# EAGLE design coverter_board (EAGLE 9.4.2)
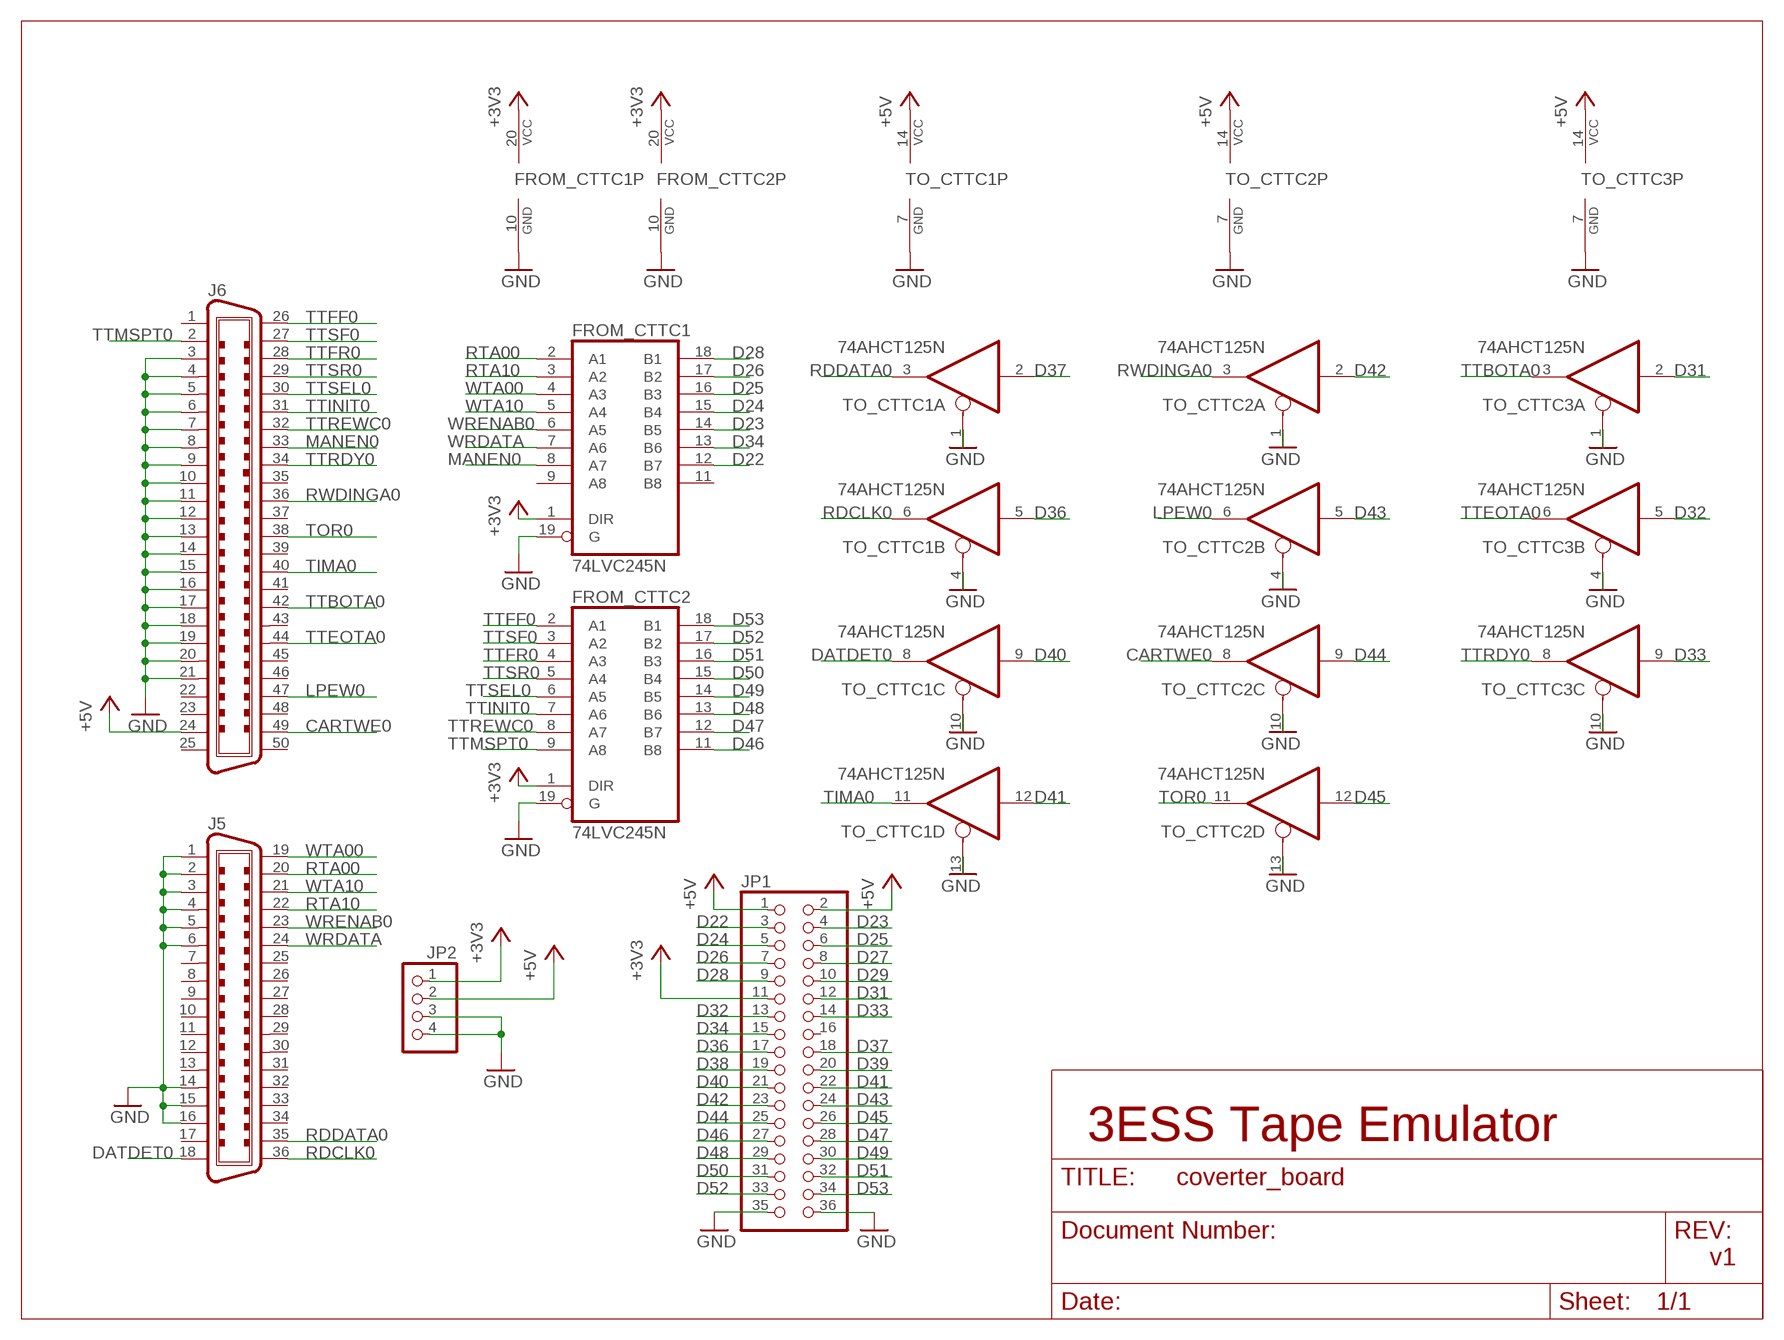
[diagram p0: schematic, sheet 1]

## Parts
FROM_CTTC1  74LVC245N  [DIL20]
FROM_CTTC2  74LVC245N  [DIL20]
J5  C36V  [36V]
J6  C50V  [50V]
JP1  PINHD-2X18  [2X18]
JP2  PINHD-1X4  [1X04]
TO_CTTC1  74AHCT125N  [DIL14]
TO_CTTC2  74AHCT125N  [DIL14]
TO_CTTC3  74AHCT125N  [DIL14]

## Nets
+3V3: FROM_CTTC1.1(DIR) FROM_CTTC1.20(VCC) FROM_CTTC2.1(DIR) FROM_CTTC2.20(VCC) JP1.11 JP2.1
+5V: J6.24 JP1.1 JP1.2 JP2.2 TO_CTTC1.14(P:VCC) TO_CTTC2.14(P:VCC) TO_CTTC3.14(P:VCC)
CARTWE0: J6.49 TO_CTTC2.8(C:O)
D22: FROM_CTTC1.12(B7) JP1.3
D23: FROM_CTTC1.14(B5) JP1.4
D24: FROM_CTTC1.15(B4) JP1.5
D25: FROM_CTTC1.16(B3) JP1.6
D26: FROM_CTTC1.17(B2) JP1.7
D27: JP1.8
D28: FROM_CTTC1.18(B1) JP1.9
D29: JP1.10
D31: JP1.12 TO_CTTC3.2(A:I)
D32: JP1.13 TO_CTTC3.5(B:I)
D33: JP1.14 TO_CTTC3.9(C:I)
D34: FROM_CTTC1.13(B6) JP1.15
D36: JP1.17 TO_CTTC1.5(B:I)
D37: JP1.18 TO_CTTC1.2(A:I)
D38: JP1.19
D39: JP1.20
D40: JP1.21 TO_CTTC1.9(C:I)
D41: JP1.22 TO_CTTC1.12(D:I)
D42: JP1.23 TO_CTTC2.2(A:I)
D43: JP1.24 TO_CTTC2.5(B:I)
D44: JP1.25 TO_CTTC2.9(C:I)
D45: JP1.26 TO_CTTC2.12(D:I)
D46: FROM_CTTC2.11(B8) JP1.27
D47: FROM_CTTC2.12(B7) JP1.28
D48: FROM_CTTC2.13(B6) JP1.29
D49: FROM_CTTC2.14(B5) JP1.30
D50: FROM_CTTC2.15(B4) JP1.31
D51: FROM_CTTC2.16(B3) JP1.32
D52: FROM_CTTC2.17(B2) JP1.33
D53: FROM_CTTC2.18(B1) JP1.34
DATDET0: J5.18 TO_CTTC1.8(C:O)
GND: FROM_CTTC1.10(GND) FROM_CTTC1.19(G) FROM_CTTC2.10(GND) FROM_CTTC2.19(G) J5.1 J5.2 J5.3 J5.4 J5.5 J5.6 J5.14 J5.15 J5.16 J6.3 J6.4 J6.5 J6.6 J6.7 J6.8 J6.9 J6.10 J6.11 J6.12 J6.13 J6.14 J6.15 J6.16 J6.17 J6.18 J6.19 J6.20 J6.21 JP1.35 JP1.36 JP2.3 JP2.4 TO_CTTC1.1(A:OE) TO_CTTC1.4(B:OE) TO_CTTC1.7(P:GND) TO_CTTC1.10(C:OE) TO_CTTC1.13(D:OE) TO_CTTC2.1(A:OE) TO_CTTC2.4(B:OE) TO_CTTC2.7(P:GND) TO_CTTC2.10(C:OE) TO_CTTC2.13(D:OE) TO_CTTC3.1(A:OE) TO_CTTC3.4(B:OE) TO_CTTC3.7(P:GND) TO_CTTC3.10(C:OE)
LPEW0: J6.47 TO_CTTC2.6(B:O)
MANEN0: FROM_CTTC1.8(A7) J6.33
RDCLK0: J5.36 TO_CTTC1.6(B:O)
RDDATA0: J5.35 TO_CTTC1.3(A:O)
RTA00: FROM_CTTC1.2(A1) J5.20
RTA10: FROM_CTTC1.3(A2) J5.22
RWDINGA0: J6.36 TO_CTTC2.3(A:O)
TIMA0: J6.40 TO_CTTC1.11(D:O)
TOR0: J6.38 TO_CTTC2.11(D:O)
TTBOTA0: J6.42 TO_CTTC3.3(A:O)
TTEOTA0: J6.44 TO_CTTC3.6(B:O)
TTFF0: FROM_CTTC2.2(A1) J6.26
TTFR0: FROM_CTTC2.4(A3) J6.28
TTINIT0: FROM_CTTC2.7(A6) J6.31
TTMSPT0: FROM_CTTC2.9(A8) J6.2
TTRDY0: J6.34 TO_CTTC3.8(C:O)
TTREWC0: FROM_CTTC2.8(A7) J6.32
TTSEL0: FROM_CTTC2.6(A5) J6.30
TTSF0: FROM_CTTC2.3(A2) J6.27
TTSR0: FROM_CTTC2.5(A4) J6.29
WRDATA: FROM_CTTC1.7(A6) J5.24
WRENAB0: FROM_CTTC1.6(A5) J5.23
WTA00: FROM_CTTC1.4(A3) J5.19
WTA10: FROM_CTTC1.5(A4) J5.21
Unconnected: FROM_CTTC1.9(A8) FROM_CTTC1.11(B8) J5.7 J5.8 J5.9 J5.10 J5.11 J5.12 J5.13 J5.17 J5.25 J5.26 J5.27 J5.28 J5.29 J5.30 J5.31 J5.32 J5.33 J5.34 J6.1 J6.22 J6.23 J6.25 J6.35 J6.37 J6.39 J6.41 J6.43 J6.45 J6.46 J6.48 J6.50 JP1.16 TO_CTTC3.11(D:O) TO_CTTC3.12(D:I) TO_CTTC3.13(D:OE)

## Notes on the sheet
- 3ESS Tape Emulator
- v1

## Library data of the parts
FROM_CTTC1 FROM_CTTC2 = 74xx-custom:74*245: Octal BUS TRANSCEIVER, 3-state
J5 = con-amp-champ:C36V: CONNECTOR; OC_FARNELL: unknown; OC_NEWARK: unknown
J6 = con-amp-champ:C50V: CONNECTOR; OC_FARNELL: unknown; OC_NEWARK: unknown
JP1 = pinhead:PINHD-2X18: PIN HEADER
JP2 = pinhead:PINHD-1X4: PIN HEADER
TO_CTTC1-TO_CTTC3 = 74xx-custom:74*125: Quad bus BUFFER, 3-state

## Net classes
0 default: clearance 0.205 mm

## Board
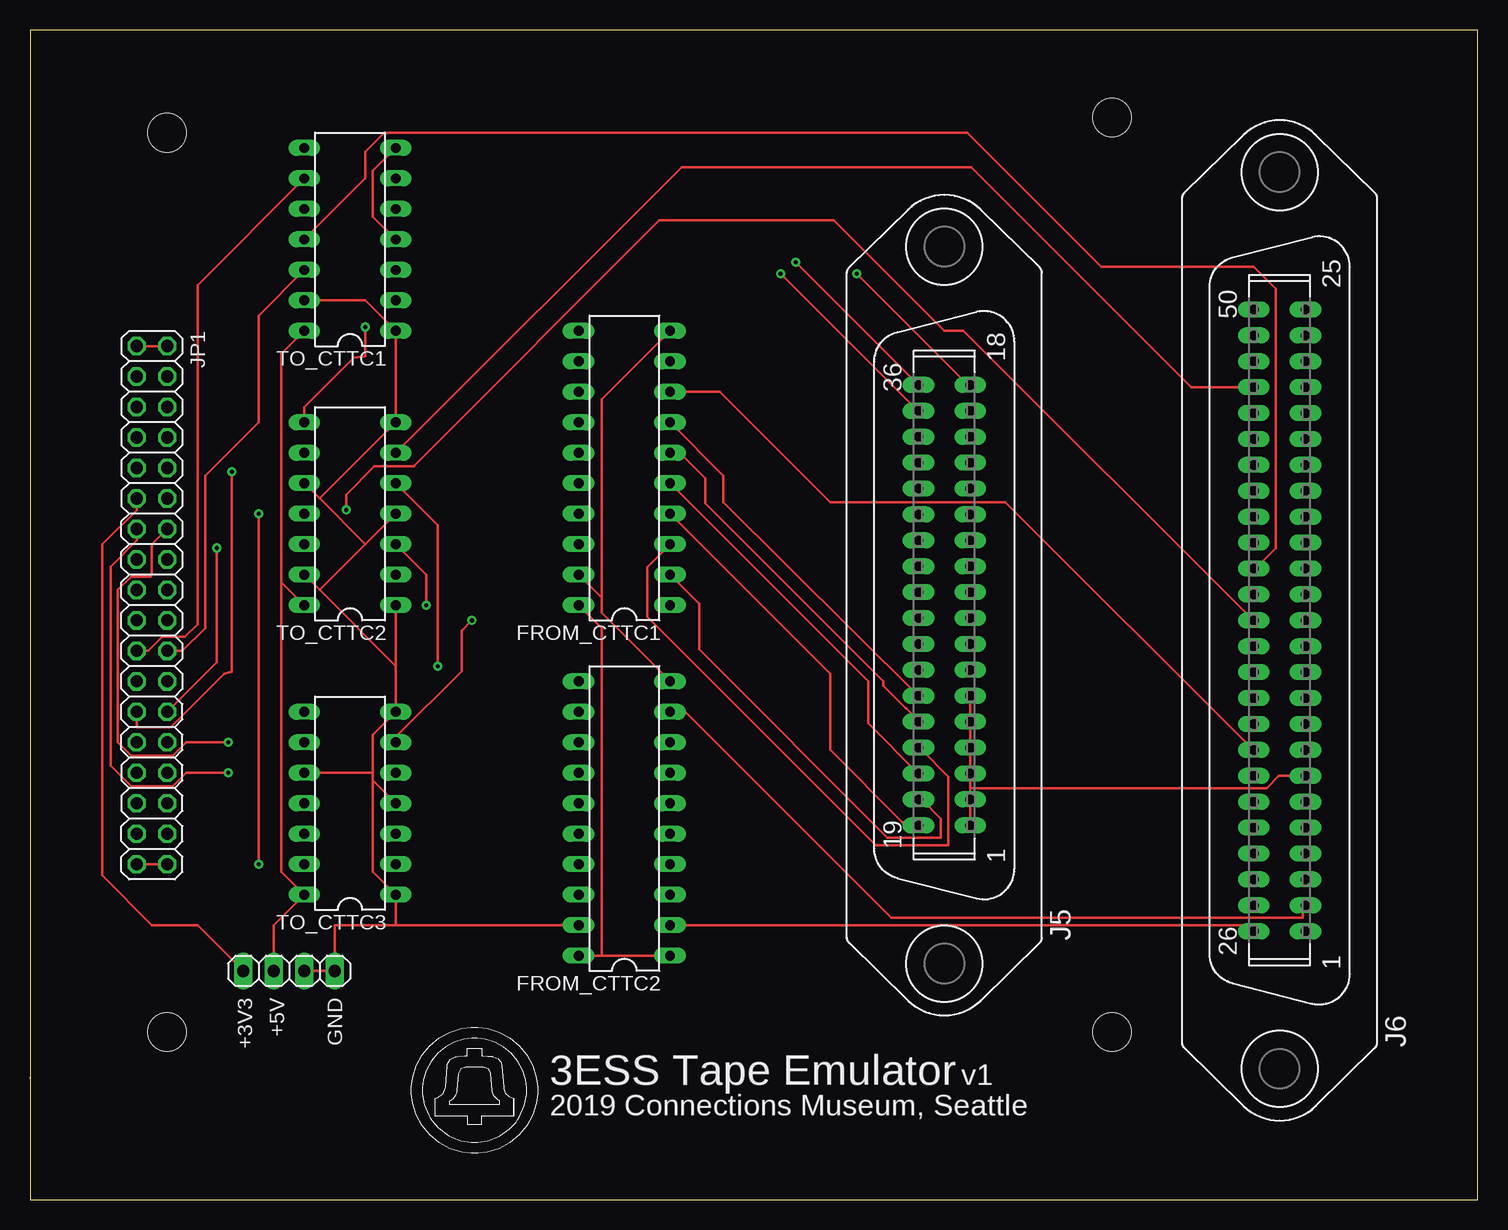
[diagram p1: board, top side]
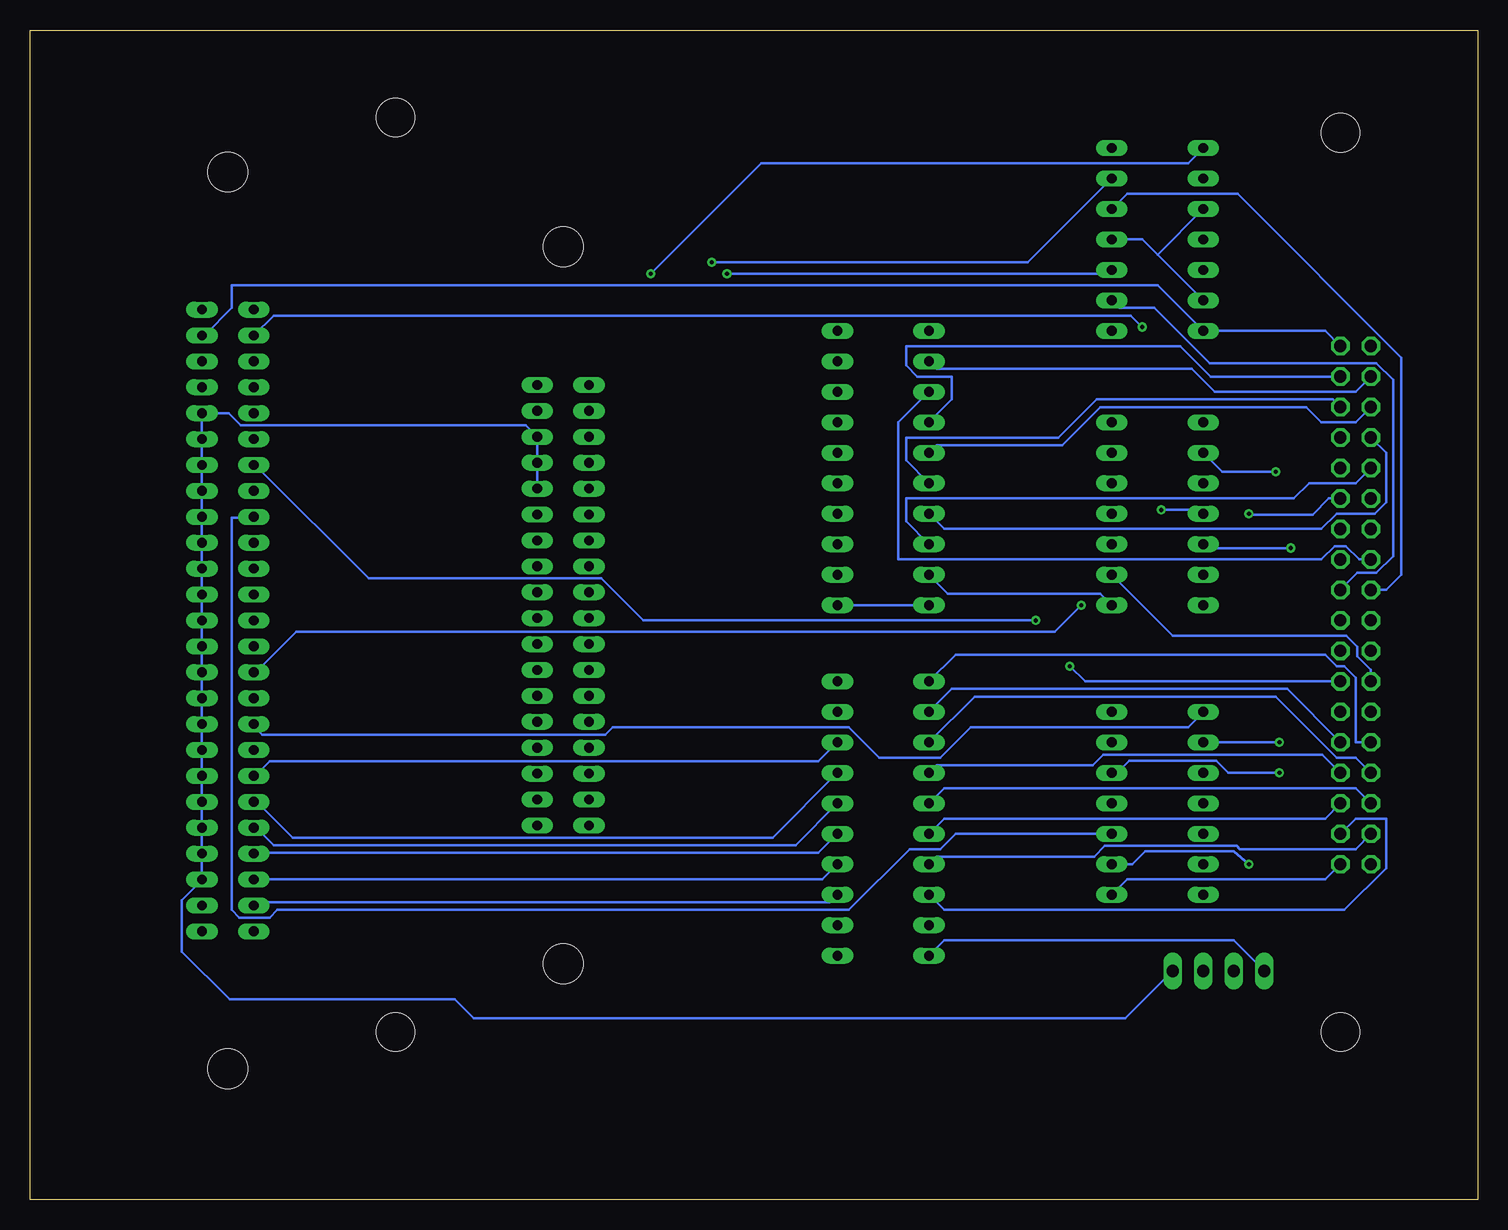
[diagram p2: board, bottom side, seen from below]

Size 120.63 x 97.46 mm. Coordinates in mm from the lower left corner, seen from the top.
Outline: 0,0 120.63,0 120.63,97.46 0,97.46 0,0
Copper layers (1*16): Top 0.035mm / dielectric 1.5mm / Bottom 0.035mm
Design rules "coverter_board *": minimum track width 0.2mm, minimum drill 0.35mm, track to track 0.25mm, track to pad 0.255mm, pad to pad 0.255mm, via to via 0.255mm, smd to smd 6mil, copper to edge 6mil, drill to drill 0.2mm, minimum pad ring 10mil, minimum via ring 8mil, stop-mask expansion 4mil, vias tented up to drill 0mil, thermal gap 10mil
Holes 3.2 mm at 90.17,90.17 11.43,88.9 11.43,13.97 90.17,13.97

### Footprints (pad centres in the part's own frame; a part is rotated, then mirrored left to right if it is on the bottom)
DIL20 = drill 0.813 long: 1 -11.43,-3.81; 2 -8.89,-3.81; 3 -6.35,-3.81; 4 -3.81,-3.81; 5 -1.27,-3.81; 6 1.27,-3.81; 7 3.81,-3.81; 8 6.35,-3.81; 9 8.89,-3.81; 10 11.43,-3.81; 11 11.43,3.81; 12 8.89,3.81; 13 6.35,3.81; 14 3.81,3.81; 15 1.27,3.81; 16 -1.27,3.81; 17 -3.81,3.81; 18 -6.35,3.81; 19 -8.89,3.81; 20 -11.43,3.81
36V = drill 0.813 long: 1 -18.352,-2.159; 2 -16.192,-2.159; 3 -14.034,-2.159; 4 -11.874,-2.159; 5 -9.716,-2.159; 6 -7.556,-2.159; 7 -5.397,-2.159; 8 -3.239,-2.159; 9 -1.079,-2.159; 10 1.079,-2.159; 11 3.239,-2.159; 12 5.397,-2.159; 13 7.556,-2.159; 14 9.716,-2.159; 15 11.874,-2.159; 16 14.034,-2.159; 17 16.192,-2.159; 18 18.352,-2.159; 19 -18.352,2.159; 20 -16.192,2.159; 21 -14.034,2.159; 22 -11.874,2.159; 23 -9.716,2.159; 24 -7.556,2.159; 25 -5.397,2.159; 26 -3.239,2.159; 27 -1.079,2.159; 28 1.079,2.159; 29 3.239,2.159; 30 5.397,2.159; 31 7.556,2.159; 32 9.716,2.159; 33 11.874,2.159; 34 14.034,2.159; 35 16.192,2.159; 36 18.352,2.159 | hole 3.302: -29.87,0; 29.87,0
50V = drill 0.813 long: 1 -25.908,-2.159; 2 -23.749,-2.159; 3 -21.59,-2.159; 4 -19.431,-2.159; 5 -17.272,-2.159; 6 -15.113,-2.159; 7 -12.954,-2.159; 8 -10.795,-2.159; 9 -8.636,-2.159; 10 -6.477,-2.159; 11 -4.318,-2.159; 12 -2.159,-2.159; 13 0,-2.159; 14 2.159,-2.159; 15 4.318,-2.159; 16 6.477,-2.159; 17 8.636,-2.159; 18 10.795,-2.159; 19 12.954,-2.159; 20 15.113,-2.159; 21 17.272,-2.159; 22 19.431,-2.159; 23 21.59,-2.159; 24 23.749,-2.159; 25 25.908,-2.159; 26 -25.908,2.159; 27 -23.749,2.159; 28 -21.59,2.159; 29 -19.431,2.159; 30 -17.272,2.159; 31 -15.113,2.159; 32 -12.954,2.159; 33 -10.795,2.159; 34 -8.636,2.159; 35 -6.477,2.159; 36 -4.318,2.159; 37 -2.159,2.159; 38 0,2.159; 39 2.159,2.159; 40 4.318,2.159; 41 6.477,2.159; 42 8.636,2.159; 43 10.795,2.159; 44 12.954,2.159; 45 15.113,2.159; 46 17.272,2.159; 47 19.431,2.159; 48 21.59,2.159; 49 23.749,2.159; 50 25.908,2.159 | hole 3.302: -37.363,0; 37.363,0
2X18 = drill 1.016 octagon: 1 -21.59,-1.27; 2 -21.59,1.27; 3 -19.05,-1.27; 4 -19.05,1.27; 5 -16.51,-1.27; 6 -16.51,1.27; 7 -13.97,-1.27; 8 -13.97,1.27; 9 -11.43,-1.27; 10 -11.43,1.27; 11 -8.89,-1.27; 12 -8.89,1.27; 13 -6.35,-1.27; 14 -6.35,1.27; 15 -3.81,-1.27; 16 -3.81,1.27; 17 -1.27,-1.27; 18 -1.27,1.27; 19 1.27,-1.27; 20 1.27,1.27; 21 3.81,-1.27; 22 3.81,1.27; 23 6.35,-1.27; 24 6.35,1.27; 25 8.89,-1.27; 26 8.89,1.27; 27 11.43,-1.27; 28 11.43,1.27; 29 13.97,-1.27; 30 13.97,1.27; 31 16.51,-1.27; 32 16.51,1.27; 33 19.05,-1.27; 34 19.05,1.27; 35 21.59,-1.27; 36 21.59,1.27
1X04 = drill 1.016 long: 1 -3.81,0; 2 -1.27,0; 3 1.27,0; 4 3.81,0
DIL14 = drill 0.813 long: 1 -7.62,-3.81; 2 -5.08,-3.81; 3 -2.54,-3.81; 4 0,-3.81; 5 2.54,-3.81; 6 5.08,-3.81; 7 7.62,-3.81; 8 7.62,3.81; 9 5.08,3.81; 10 2.54,3.81; 11 0,3.81; 12 -2.54,3.81; 13 -5.08,3.81; 14 -7.62,3.81

### Placement (x,y rotation side)
FROM_CTTC1  49.53,60.96 90 top
FROM_CTTC2  49.53,31.75 90 top
J5  76.2,49.53 90 top
J6  104.14,48.26 90 top
JP1  10.16,49.53 270 top
JP2  21.59,19.05 0 top
TO_CTTC1  26.67,80.01 90 top
TO_CTTC2  26.67,57.15 90 top
TO_CTTC3  26.67,33.02 90 top

### Tracks (layer width: path | path; a pad name or v marks a point on that pad's centre or on a via)
+3V3
  Top 0.2: FROM_CTTC2.1 47.63,20.32 | 47.63,20.32 FROM_CTTC2.20 | FROM_CTTC1.20 47.63,47.62 47.63,20.32 | JP1.11 8.89,57.46 6.02,54.59 6.02,27 10.16,22.86 13.97,22.86 JP2.1
  Bottom 0.2: FROM_CTTC1.1 FROM_CTTC1.20 | JP2.1 20.32,21.59 44.45,21.59 FROM_CTTC2.20
+5V
  Top 0.2: JP2.2 20.32,22.86 TO_CTTC3.14 20.96,27.3 20.96,51.43 | JP1.2 JP1.1 | 20.96,51.43 TO_CTTC2.14 | 20.96,51.43 20.96,70.48 TO_CTTC1.14
  Bottom 0.2: J6.24 106.04,72.07 103.82,74.3 103.82,76.2 26.67,76.2 TO_CTTC1.14 12.7,72.39 JP1.2
CARTWE0  (via drill 0.35)
  Top 0.2: TO_CTTC2.8 22.86,66.04 26.99,70.17 27.94,70.29 v27.94,72.71
  Bottom 0.2: v27.94,72.71 28.89,73.66 100.33,73.66 J6.49
D22
  Bottom 0.2: FROM_CTTC1.12 45.09,69.22 23.81,69.22 21.91,67.31 10.16,67.31 JP1.3
D23
  Bottom 0.2: FROM_CTTC1.14 43.82,66.67 43.82,68.58 46.67,68.58 47.63,69.53 47.63,71.12 24.77,71.12 22.23,68.58 JP1.4
D24
  Bottom 0.2: FROM_CTTC1.15 45.09,62.87 34.61,62.87 31.43,66.04 14.29,66.04 13.02,64.77 10.16,64.77 JP1.5
D25
  Bottom 0.2: FROM_CTTC1.16 47.63,61.59 47.63,63.5 34.93,63.5 31.75,66.67 12.07,66.67 JP1.6
D26
  Bottom 0.2: FROM_CTTC1.17 44.45,55.88 13.02,55.88 11.75,57.15 8.57,57.15 7.62,58.1 7.62,62.23 JP1.7
D28
  Bottom 0.2: FROM_CTTC1.18 47.63,56.51 47.63,58.42 15.3,58.42 14.03,59.69 10.16,59.69 JP1.9
D31  (via drill 0.35)
  Top 0.2: v19.05,57.15 v19.05,27.94
  Bottom 0.2: TO_CTTC3.2 28.77,27.94 27.69,29.01 20.32,29.01 v19.05,27.94 | v19.05,57.15 18.98,57.08 13.72,57.08 12.38,58.42 JP1.12
D32  (via drill 0.35)
  Top 0.2: JP1.13 8.89,54.92 6.72,52.75 6.72,36.15 8.43,34.44 11.89,34.44 13.01,35.56 v16.51,35.56
  Bottom 0.2: v16.51,35.56 20.76,35.56 21.78,36.57 29.02,36.57 30.04,35.56 TO_CTTC3.5
D33  (via drill 0.35)
  Top 0.2: JP1.14 10.16,54.61 10.16,52.07 10.01,51.92 8.43,51.92 7.31,50.8 7.3,50.8 7.3,38.1 7.31,38.1 8.43,36.98 11.89,36.98 13.01,38.1 v16.51,38.1
  Bottom 0.2: v16.51,38.1 TO_CTTC3.9
D34
  Bottom 0.2: FROM_CTTC1.13 48.26,64.77 48.26,53.34 13.01,53.34 11.89,54.46 10.97,54.46 9.85,53.34 JP1.15
D36
  Bottom 0.2: TO_CTTC1.5 29.21,83.82 20,83.82 6.35,70.17 6.35,52.07 7.62,50.8 JP1.17
D37
  Bottom 0.2: TO_CTTC1.2 29.85,74.3 26.92,74.3 22.33,69.7 8.43,69.7 7.04,68.31 7.04,53.61 8.43,52.22 10.01,52.22 JP1.18
D40
  Top 0.2: TO_CTTC1.9 13.97,76.2 13.97,47.95 12.91,46.89 11.02,46.89 9.85,45.72 JP1.21
D41
  Top 0.2: JP1.22 12.7,45.72 14.61,47.62 14.61,60.32 19.05,64.77 19.05,73.66 TO_CTTC1.12
D42
  Bottom 0.2: TO_CTTC2.2 25.4,46.99 10.92,46.99 10.01,46.07 10.01,45.26 8.89,44.14 JP1.23
D43  (via drill 0.35)
  Top 0.2: TO_CTTC2.5 33.97,56.2 v33.97,44.45
  Bottom 0.2: v33.97,44.45 32.7,43.18 JP1.24
D44  (via drill 0.35)
  Top 0.2: v16.83,60.64 16.83,43.97 16.19,43.81 11.75,39.37 8.89,39.37 JP1.25
  Bottom 0.2: TO_CTTC2.9 21.27,60.64 v16.83,60.64
D45  (via drill 0.35)
  Top 0.2: JP1.26 15.56,44.77 v15.56,54.29
  Bottom 0.2: TO_CTTC2.12 22.54,54.29 v15.56,54.29
D46
  Bottom 0.2: FROM_CTTC2.11 43.5,45.4 12.7,45.4 11.75,44.45 11.11,44.45 10.16,43.5 10.16,38.1 JP1.27
D47
  Bottom 0.2: FROM_CTTC2.12 43.82,42.54 15.88,42.54 JP1.28
D48
  Bottom 0.2: FROM_CTTC2.13 41.91,41.91 16.83,41.91 11.75,36.83 10.16,36.83 JP1.29
D49
  Bottom 0.2: FROM_CTTC2.14 45.09,36.2 32.07,36.2 31.18,37.08 12.95,37.08 JP1.30
D50
  Bottom 0.2: FROM_CTTC2.15 44.45,34.29 10.16,34.29 JP1.31
D51
  Bottom 0.2: FROM_CTTC2.16 44.45,31.75 12.7,31.75 JP1.32
D52
  Bottom 0.2: FROM_CTTC2.17 45.09,28.57 31.94,28.57 31.05,29.46 20.34,29.46 20.17,29.48 20.16,29.46 20.06,29.46 19.81,29.21 10.16,29.21 JP1.33
D53
  Bottom 0.2: FROM_CTTC2.18 44.45,24.13 11.11,24.13 7.62,27.62 7.62,31.75 10.16,31.75 JP1.34
DATDET0  (via drill 0.35)
  Top 0.2: v68.9,77.15 78.1,67.95 J5.18
  Bottom 0.2: TO_CTTC1.8 24.13,86.36 59.69,86.36 v68.9,77.15
GND
  Top 0.2: FROM_CTTC2.10 47.63,48.89 47.63,50.16 | FROM_CTTC1.19 47.63,50.16 | FROM_CTTC1.10 47.63,66.67 47.63,50.16 | TO_CTTC1.7 28.57,85.73 28.57,81.92 TO_CTTC1.4 | JP1.36 JP1.35 | JP2.3 JP2.4 25.4,22.86 30.48,22.86 | 28.57,35.56 TO_CTTC3.10 | 28.57,34.92 28.57,35.56 | TO_CTTC3.4 28.57,34.92 | 28.57,34.92 28.57,27.3 TO_CTTC3.1 30.48,22.86 | 28.57,35.56 28.57,38.73 TO_CTTC3.7 30.48,44.45 | 30.48,22.86 FROM_CTTC2.19 | 30.48,44.45 TO_CTTC2.1 | 30.48,44.45 24.13,50.8 | 24.13,50.8 TO_CTTC2.13 | 24.13,50.8 27.94,54.61 | 27.94,54.61 TO_CTTC2.4 | 27.94,54.61 24.13,58.42 | 24.13,58.42 TO_CTTC2.10 | 24.13,58.42 TO_CTTC2.7 TO_CTTC1.1 27.94,74.93 TO_CTTC1.13 | 78.36,34.29 J5.3 J5.4 J5.5 J5.6 | 78.36,34.29 J5.2 J5.1 | J6.7 104.08,35.31 103.06,34.29 78.36,34.29
  Bottom 0.2: 26.67,78.74 27.94,80.01 TO_CTTC1.4 | 26.67,78.74 TO_CTTC1.13 | 26.67,78.74 TO_CTTC1.10 | JP1.36 12.7,26.67 29.21,26.67 TO_CTTC3.1 | FROM_CTTC1.19 44.13,50.48 31.43,50.48 TO_CTTC2.1 | J5.14 J5.15 J5.16 79.31,64.52 103.06,64.52 104.08,65.53 J6.21 J6.20 J6.19 J6.18 J6.17 J6.16 J6.15 J6.14 J6.13 J6.12 J6.11 J6.10 J6.9 J6.8 J6.7 J6.6 J6.5 J6.4 J6.3 106.3,26.61 107.97,24.93 107.97,20.66 104,16.69 85.24,16.69 83.64,15.09 29.35,15.09 JP2.4
LPEW0
  Top 0.2: TO_CTTC2.6 54.29,86.04 78.42,86.04 96.77,67.69 J6.47
MANEN0
  Top 0.2: FROM_CTTC1.8 57.47,67.31 66.68,58.1 81.28,58.1 101.92,37.46 J6.33
RDCLK0  (via drill 0.35)
  Top 0.2: J5.36 v63.82,78.11
  Bottom 0.2: TO_CTTC1.6 37.46,78.11 v63.82,78.11
RDDATA0  (via drill 0.35)
  Top 0.2: v62.55,77.15 73.98,65.72 J5.35
  Bottom 0.2: TO_CTTC1.3 30.8,77.15 v62.55,77.15
RTA00
  Top 0.2: FROM_CTTC1.2 55.75,49.66 55.75,45.85 71.44,30.16 75.88,30.16 75.88,31.75 74.3,33.34 J5.20
RTA10
  Top 0.2: FROM_CTTC1.3 51.44,52.7 51.44,48.58 70.49,29.53 76.52,29.53 76.52,35.24 74.3,37.46 J5.22
RWDINGA0  (via drill 0.35)
  Top 0.2: TO_CTTC2.3 33.02,52.07 v33.02,49.53
  Bottom 0.2: v33.02,49.53 35.24,47.31 98.42,47.31 101.6,44.13 101.92,44.13 J6.36
TIMA0
  Top 0.2: TO_CTTC1.11 27.94,85.09 27.94,87.31 29.53,88.9 78.1,88.9 89.28,77.72 101.98,77.72 103.82,75.88 103.82,54.29 102.23,52.7 J6.40
TOR0  (via drill 0.35)
  Top 0.2: v26.35,57.47 26.35,58.74 28.7,61.09 32,61.09 32,61.15 52.45,81.6 66.99,81.6 76.2,72.39 77.79,72.39 101.92,48.26 J6.38
  Bottom 0.2: TO_CTTC2.11 23.18,57.47 v26.35,57.47
TTBOTA0
  Bottom 0.2: TO_CTTC3.3 43.5,30.48 44.77,29.21 47.31,29.21 52.39,24.13 100.01,24.13 100.65,23.5 103.19,23.5 103.82,24.13 103.82,56.83 102.23,56.83 J6.42
TTEOTA0  (via drill 0.35)
  Top 0.2: v36.83,48.26 35.98,47.41 35.98,44.04 30.48,38.54 TO_CTTC3.6
  Bottom 0.2: v36.83,48.26 69.53,48.26 73.03,51.75 92.39,51.75 101.6,60.96 101.92,60.96 J6.44
TTFF0
  Top 0.2: FROM_CTTC2.2 101.92,22.86 101.92,22.54 J6.26
TTFR0
  Bottom 0.2: FROM_CTTC2.4 54.61,26.67 J6.28
TTINIT0
  Bottom 0.2: FROM_CTTC2.7 58.74,30.16 98.74,30.16 101.6,33.02 101.92,33.02 J6.31
TTMSPT0
  Top 0.2: FROM_CTTC2.9 54.61,40.64 71.75,23.5 106.04,23.5 106.04,24.45 J6.2
TTRDY0
  Bottom 0.2: TO_CTTC3.8 24.13,39.37 42.23,39.37 44.77,36.83 49.85,36.83 52.39,39.37 72.07,39.37 72.71,38.73 78.74,38.73 101.28,38.73 101.92,39.37 J6.34
TTREWC0
  Bottom 0.2: FROM_CTTC2.8 54.93,36.51 100.65,36.51 101.6,35.56 101.92,35.56 J6.32
TTSEL0
  Bottom 0.2: FROM_CTTC2.6 56.83,29.53 100.33,29.53 101.6,30.8 101.92,30.8 J6.30
TTSF0
  Bottom 0.2: FROM_CTTC2.3 53.98,24.77 101.92,24.77 J6.27
TTSR0
  Bottom 0.2: FROM_CTTC2.5 54.93,28.89 101.92,28.89 J6.29
WRDATA
  Top 0.2: FROM_CTTC1.7 57.79,60.32 57.79,58.12 J5.24
WRENAB0
  Top 0.2: J5.23 73.98,40 73.02,40.96 72.96,40.96 71.09,42.82 71.09,43.2 56.29,58.01 56.29,60.11 54.17,62.23 FROM_CTTC1.6
WTA00
  Top 0.2: FROM_CTTC1.4 66.68,43.81 66.68,37.46 72.71,31.43 73.98,31.43 J5.19
WTA10
  Top 0.2: J5.21 69.85,39.69 69.85,43.18 FROM_CTTC1.5

### Text on the board
tPlace: +5V | +3V3 | GND | 3ESS Tape Emulator | v1 | 2019 Connections Museum, Seattle